# Altium schematic sheet USBBracket.SchDoc
size A4
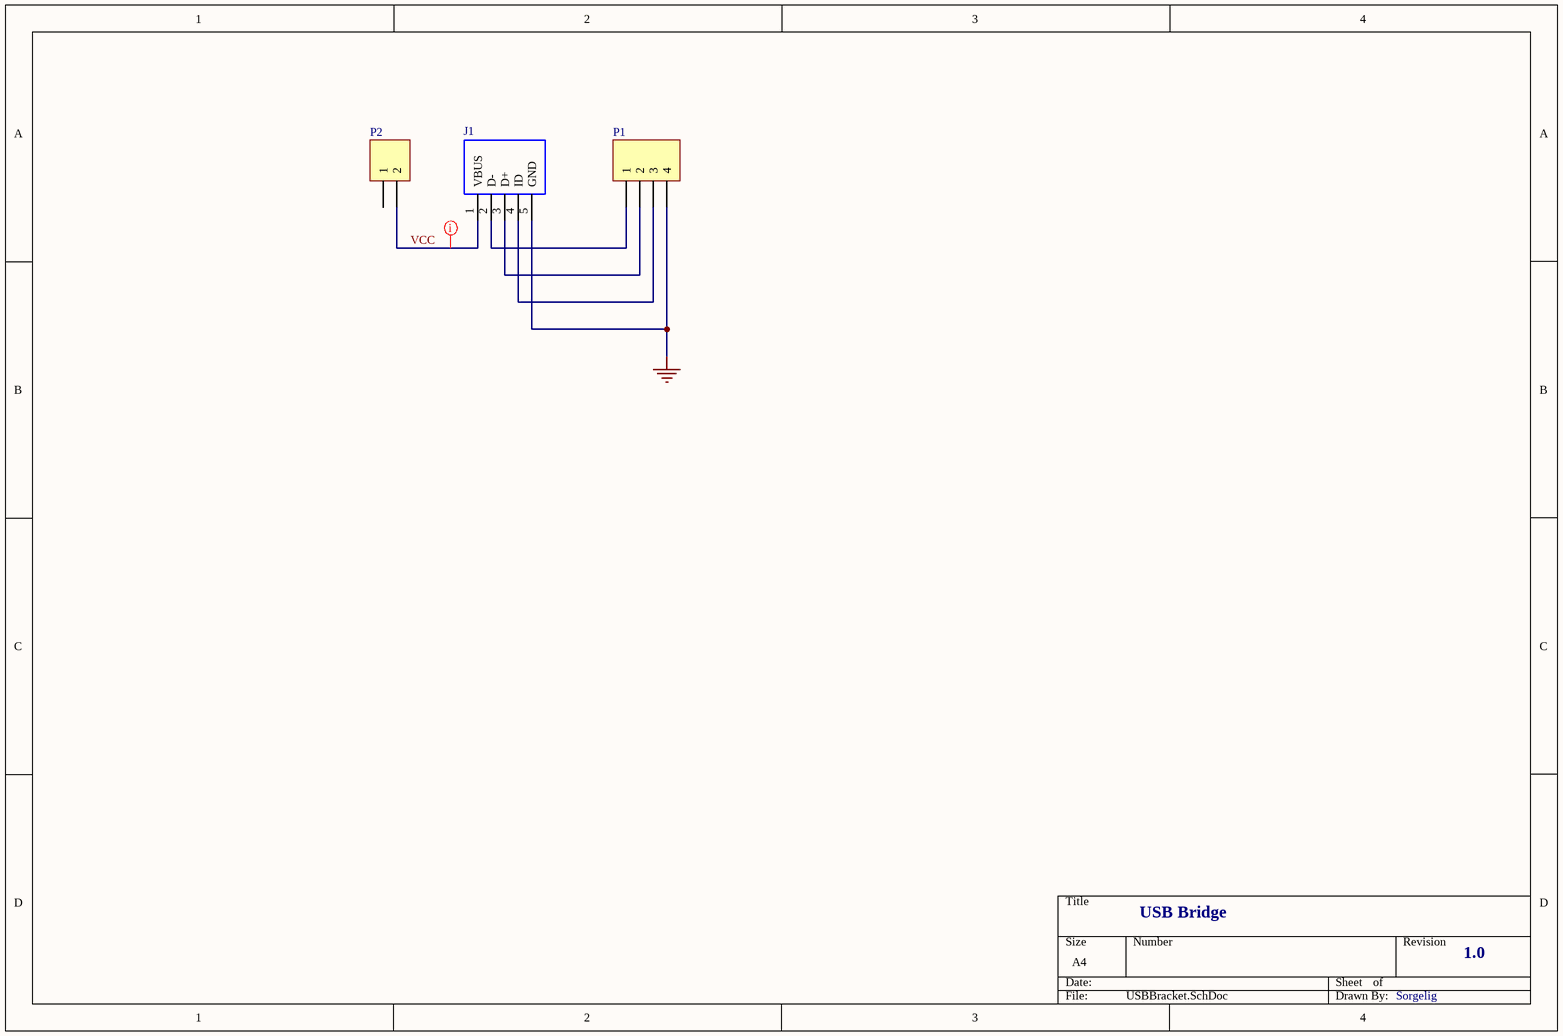
[diagram p0: USBBracket.SchDoc]

## Parts
J1  MicroUSB-L  [MicroUSB-L]  (value not drawn)
P1  Header 4  [HDR1X4]  (value not drawn)
P2  Header 2  [HDR1X2]  (value not drawn)

## Nets
GND: J1.5(GND) P1.4
VCC: J1.1(VBUS) P2.2
NetJ1_2: J1.2(D-) P1.1
NetJ1_3: J1.3(D+) P1.2
NetJ1_4: J1.4(ID) P1.3

Not connected (* = marked no-connect by the designer): P2 1

## Layout directives
net class power: VCC

## Notes on the sheet
- USB Bridge
- 1.0
- Sorgelig

## Library data of the parts
J1 = MicroUSB-L: Manufacturer_Name: Molex; Manufacturer_Part_Number: 47346-0001; Allied_Number: 70266948; Mouser Part Number: 538-47346-0001; Mouser Price/Stock: https://www.mouser.com/Search/Refine.aspx?Keyword=538-47346-0001; RS Part Number: 7025475P; RS Price/Stock: http://uk.rs-online.com/web/p/products/7025475P; Allied Price/Stock: https://www.alliedelec.com/molex-incorporated-47346-0001/70266948/; Datasheet Link: http://www.molex.com/pdm_docs/sd/473460001_sd.pdf
P1 = Header 4: Header, 4-Pin; LatestRevisionDate: 17-Jul-2002; LatestRevisionNote: Re-released for DXP Platform.; Publisher: Altium Limited
P2 = Header 2: Header, 2-Pin; LatestRevisionDate: 17-Jul-2002; LatestRevisionNote: Re-released for DXP Platform.; Publisher: Altium Limited